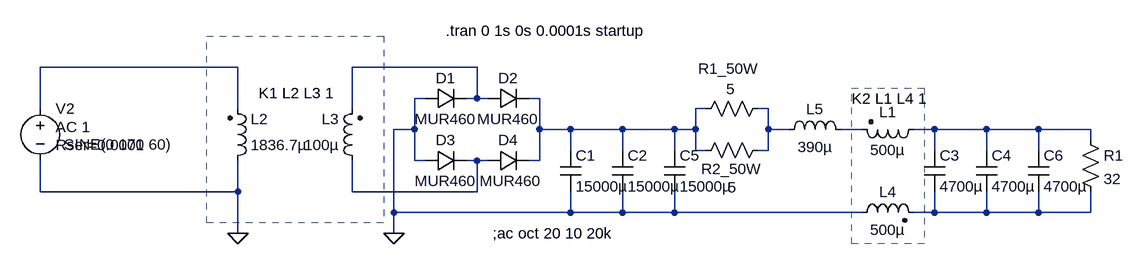
[diagram p0: schematic PScommonMode.asc]
PScommonMode.asc, the LTspice schematic file:
Version 4
SHEET 1 1416 680
WIRE -464 80 -768 80
WIRE -96 80 -288 80
WIRE -176 128 -192 128
WIRE -96 128 -96 80
WIRE -96 128 -112 128
WIRE -80 128 -96 128
WIRE 0 128 -16 128
WIRE -768 144 -768 80
WIRE -464 144 -464 80
WIRE -288 144 -288 80
WIRE 256 144 240 144
WIRE 352 144 336 144
WIRE -192 176 -192 128
WIRE -192 176 -224 176
WIRE 0 176 0 128
WIRE 48 176 0 176
WIRE 128 176 48 176
WIRE 208 176 128 176
WIRE 240 176 240 144
WIRE 240 176 208 176
WIRE 352 176 352 144
WIRE 384 176 352 176
WIRE 496 176 464 176
WIRE 608 176 576 176
WIRE 688 176 608 176
WIRE 768 176 688 176
WIRE 848 176 768 176
WIRE 848 192 848 176
WIRE 48 208 48 176
WIRE 128 208 128 176
WIRE 208 208 208 176
WIRE 240 208 240 176
WIRE 256 208 240 208
WIRE 352 208 352 176
WIRE 352 208 336 208
WIRE 608 208 608 176
WIRE 688 208 688 176
WIRE 768 208 768 176
WIRE -192 224 -192 176
WIRE -176 224 -192 224
WIRE -96 224 -112 224
WIRE -80 224 -96 224
WIRE 0 224 0 176
WIRE 0 224 -16 224
WIRE -768 272 -768 224
WIRE -464 272 -464 224
WIRE -464 272 -768 272
WIRE -288 272 -288 224
WIRE -96 272 -96 224
WIRE -96 272 -288 272
WIRE -224 304 -224 176
WIRE 48 304 48 272
WIRE 48 304 -224 304
WIRE 128 304 128 272
WIRE 128 304 48 304
WIRE 208 304 208 272
WIRE 208 304 128 304
WIRE 496 304 208 304
WIRE 608 304 608 272
WIRE 608 304 576 304
WIRE 688 304 688 272
WIRE 688 304 608 304
WIRE 768 304 768 272
WIRE 768 304 688 304
WIRE 848 304 848 272
WIRE 848 304 768 304
WIRE -464 336 -464 272
WIRE -224 336 -224 304
FLAG -224 336 0
FLAG -464 336 0
SYMBOL voltage -768 128 R0
WINDOW 3 37 71 Left 2
WINDOW 123 24 44 Left 2
WINDOW 39 24 72 Left 2
SYMATTR Value SINE(0 170 60)
SYMATTR Value2 AC 1
SYMATTR SpiceLine Rser=0.0001
SYMATTR InstName V2
SYMBOL diode -176 144 R270
WINDOW 3 0 32 VBottom 2
WINDOW 0 32 32 VTop 2
SYMATTR Value MUR460
SYMATTR InstName D1
SYMBOL diode -80 144 R270
WINDOW 0 32 32 VTop 2
WINDOW 3 0 32 VBottom 2
SYMATTR InstName D2
SYMATTR Value MUR460
SYMBOL ind2 592 160 R90
WINDOW 0 5 56 VBottom 2
WINDOW 3 32 56 VTop 2
SYMATTR InstName L1
SYMATTR Value 500µ
SYMATTR SpiceLine Rser=27m
SYMATTR Type ind
SYMBOL cap 592 208 R0
SYMATTR InstName C3
SYMATTR Value 4700µ
SYMATTR SpiceLine Rser=71m
SYMBOL diode -176 240 R270
WINDOW 0 32 32 VTop 2
WINDOW 3 0 32 VBottom 2
SYMATTR InstName D3
SYMATTR Value MUR460
SYMBOL diode -80 240 R270
WINDOW 0 32 32 VTop 2
WINDOW 3 0 36 VBottom 2
SYMATTR InstName D4
SYMATTR Value MUR460
SYMBOL cap 672 208 R0
SYMATTR InstName C4
SYMATTR Value 4700µ
SYMATTR SpiceLine Rser=71m
SYMBOL res 352 128 R90
WINDOW 0 -30 61 VBottom 2
WINDOW 3 -30 58 VTop 2
SYMATTR InstName R1_50W
SYMATTR Value 5
SYMBOL cap 112 208 R0
SYMATTR InstName C2
SYMATTR Value 15000µ
SYMATTR SpiceLine Rser=31m
SYMBOL res 352 192 R90
WINDOW 0 60 56 VBottom 2
WINDOW 3 58 56 VTop 2
SYMATTR InstName R2_50W
SYMATTR Value 5
SYMBOL cap 32 208 R0
SYMATTR InstName C1
SYMATTR Value 15000µ
SYMATTR SpiceLine Rser=31m
SYMBOL cap 752 208 R0
SYMATTR InstName C6
SYMATTR Value 4700µ
SYMATTR SpiceLine Rser=71m
SYMBOL cap 192 208 R0
SYMATTR InstName C5
SYMATTR Value 15000µ
SYMATTR SpiceLine Rser=31m
SYMBOL ind2 -480 240 M180
WINDOW 0 36 80 Left 2
WINDOW 3 36 40 Left 2
SYMATTR InstName L2
SYMATTR Value 1836.7µ
SYMATTR Type ind
SYMBOL ind2 -272 240 R180
WINDOW 0 36 80 Left 2
WINDOW 3 36 40 Left 2
SYMATTR InstName L3
SYMATTR Value 100µ
SYMATTR Type ind
SYMBOL res 832 176 R0
SYMATTR InstName R1
SYMATTR Value 32
SYMBOL ind2 480 320 R270
WINDOW 0 32 56 VTop 2
WINDOW 3 5 56 VBottom 2
SYMATTR InstName L4
SYMATTR Value 500µ
SYMATTR Type ind
SYMATTR SpiceLine Rser=27m
SYMBOL ind 368 192 R270
WINDOW 0 32 56 VTop 2
WINDOW 3 5 56 VBottom 2
SYMATTR InstName L5
SYMATTR Value 390µ
SYMATTR SpiceLine Rser=72m
TEXT -72 336 Left 2 !;ac oct 20 10 20k
TEXT -432 120 Left 2 !K1 L2 L3 1
TEXT 480 128 Left 2 !K2 L1 L4 1
TEXT -144 24 Left 2 !.tran 0 1s 0s 0.0001s startup
RECTANGLE Normal -240 320 -512 32 2
RECTANGLE Normal 592 352 480 112 2

The netlist it stands for:
* PScommonMode.asc
V2 N001 0 SINE(0 170 60) AC 1 Rser=0.0001
D1 0 N002 MUR460
D2 N002 N003 MUR460
L1 N006 N005 500µ Rser=27m
C3 N006 N008 4700µ Rser=71m
D3 0 N007 MUR460
D4 N007 N003 MUR460
C4 N006 N008 4700µ Rser=71m
R1_50W N004 N003 5
C2 N003 0 15000µ Rser=31m
R2_50W N004 N003 5
C1 N003 0 15000µ Rser=31m
C6 N006 N008 4700µ Rser=71m
C5 N003 0 15000µ Rser=31m
L2 0 N001 1836.7µ
L3 N007 N002 100µ
R1 N006 N008 32
L4 0 N008 500µ Rser=27m
L5 N004 N005 390µ Rser=72m
.model D D
.lib standard.dio
;ac oct 20 10 20k
K1 L2 L3 1
K2 L1 L4 1
.tran 0 1s 0s 0.0001s startup
.backanno
.end